# Altium schematic sheet Input_AC.SchDoc
size A4
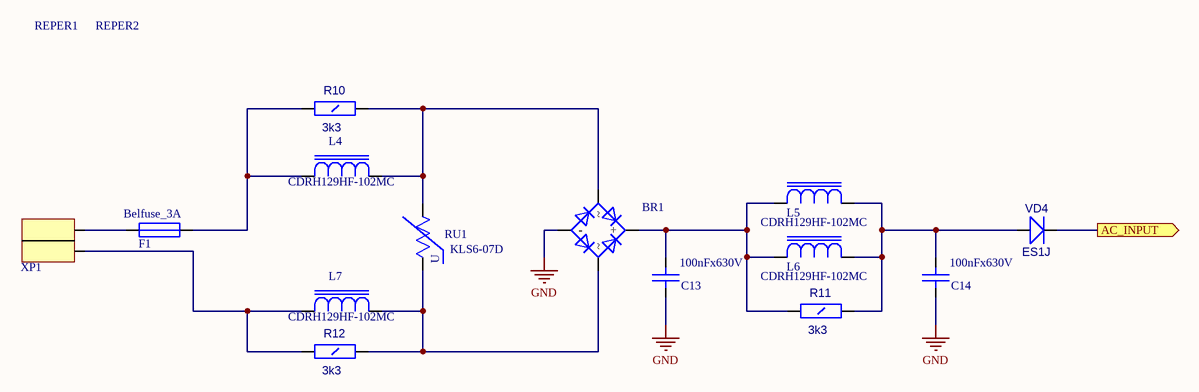
[diagram p0: Input_AC.SchDoc]

## Parts
BR1  DF10S  [SDIP]  (value not drawn)
C13  100nFx630V  [CAP_630V_SMD]
C14  100nFx630V  [CAP_630V_SMD]
F1  Belfuse_3A  [Fuse Belfuse]
L4  CDRH129HF-102MC  [IND_CDRH129]
L5  CDRH129HF-102MC  [IND_CDRH129]
L6  CDRH129HF-102MC  [IND_CDRH129]
L7  CDRH129HF-102MC  [IND_CDRH129]
R10  3k3  [RC1206]
R11  3k3  [RC1206]
R12  3k3  [RC1206]
REPER1  REPER1.2  [REPER1.2]  (value not drawn)
REPER2  REPER1.2  [REPER1.2]  (value not drawn)
RU1  KLS6-07D  [Varistor_7mm_SMD]
VD4  ES1J  [SMA]
XP1  *  [Poke-In 2pin]  (value not drawn)

## Ports
AC_INPUT (out)

## Nets
GND: BR1.2(-) C13.1(A) C14.1(A)
AC_INPUT: VD4.2(K) ; port AC_INPUT
NetBR1_1: BR1.1(+) C13.2(B) L5.1(A) L6.1(A) R11.1(A)
NetBR1_3: BR1.3 L4.2(B) R10.2(B) RU1.2(B)
NetBR1_4: BR1.4 L7.2(B) R12.2(B) RU1.1(A)
NetC14_2: C14.2(B) L5.2(B) L6.2(B) R11.2(B) VD4.1(A)
NetF1_1: F1.1 L4.1(A) R10.1(A)
NetF1_2: F1.2 XP1.3
NetL7_1: L7.1(A) R12.1(A) XP1.4

Not connected (* = marked no-connect by the designer): REPER1 1; REPER2 1

## Notes on the sheet
- (in symbol KLS6-07D) U

## Library data of the parts
C13 C14 = Cap_HV: Value: 100nFx630V
F1 = Fuse Belufse: Value: Belfuse_3A
L4-L7 = CDRH129: Value: CDRH129HF-102MC
R10-R12 = RC1206: Value: 3k3
VD4 = SS14: Schottky Rectifier; OriginalName: 10BQ100; ComponentField6: Published 8-Jun-2000, Modified 10-July-2000: SIM Model Added.; Value: ES1J
XP1 = Poke-IN 2Pin: Value: *
BR1 = DF10S: Value: DF10S
REPER1 REPER2 = REPER1.2: Value: *
RU1 = KLS6-07D: Value: KLS6-07D